# Altium schematic sheet LM2596 Adjustable_AMS1117.SchDoc
size A
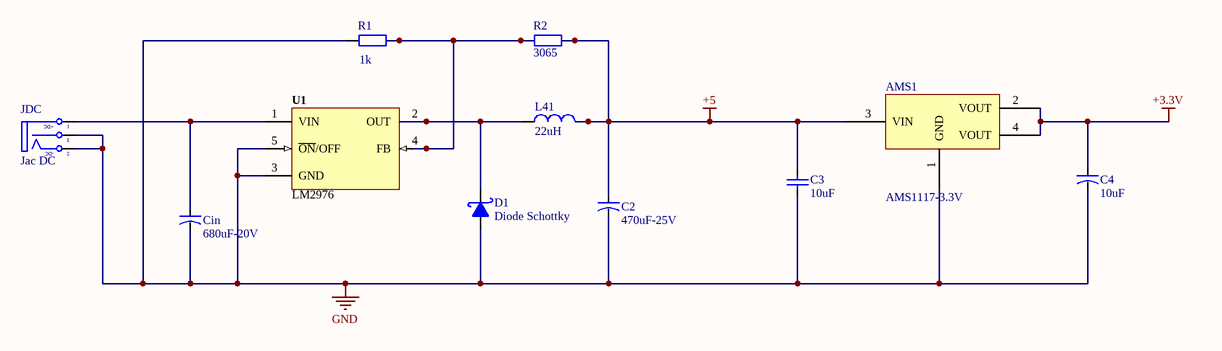
[diagram p0: LM2596 Adjustable_AMS1117.SchDoc]

## Parts
AMS1  AMS1117-3.3V  [SOT223]
C2  470uF-25V  [CAP_D16]
C3  10uF  [CAP_0805]
C4  10uF  [CAP_D16]
Cin  680uF-20V  [CAP_D16]
D1  Diode Schottky  [DIODE_ZENER_SMD]
JDC  Jac DC  [DC-IN]
L41  22uH  [Inductor_SMD]
R1  1k  [RES-SMD-0805]
R2  3065  [RES_SMD_0805]
U1  LM2976  [LM2576t]

## Nets
+3.3V: AMS1.2(VOUT) AMS1.4(VOUT) C4.1
+5: AMS1.3(VIN) C2.1 C3.2 L41.2 R2.1
GND: AMS1.1(GND) C2.2 C3.1 C4.2 Cin.2 D1.1(A) JDC.2(TN) JDC.3(S) R1.2 U1.3(GND) U1.5(~{ON}/OFF)
NetCin_1: Cin.1 JDC.1(T) U1.1(VIN)
NetD1_2: D1.2(K) L41.1 U1.2(OUT)
NetR1_1: R1.1 R2.2 U1.4(FB)

## Notes on the sheet
- (in symbol DCIN) +DC; -DC

## Library data of the parts
AMS1 = AMS1117 SMD: Dán; Value: AMS1117-3.3V SOT223; Don_Vi: Con; Ma_Hang: MH000596; Ghi_Chu: *; Kieu_Chan: *; Chung_Loai: Dán
C2 C4 Cin = CAP-ALU-DIP: Capacitor (Semiconductor SIM Model); Value: 104; LatestRevisionDate: 17-Jul-2002; LatestRevisionNote: Re-released for DXP Platform.; PackageReference: C1206; Publisher: Altium Limited
C3 = CapSMD: Capacitor; Value: 33p; Published: 8-Jun-2000; LatestRevisionDate: 17-Jul-2002; LatestRevisionNote: Re-released for DXP Platform.; PackageReference: RAD-0.3; Publisher: Altium Limited
D1 = Diode Schottky: Generic Diode Schottky
JDC = DCIN: Jac DC input; Value: Jac DC
L41 = L1: Inductor; Value: 150 mH
R1 R2 = Resistor - SMD: Resistor SMD; Manufacturer: Generic Components; Class: Passive; Published: 08/06/2000; Publisher: Altium Hobart Technology Centre
U1 = LM2596: Max Input Voltage: 12 V; Max Output Current: 3 (6.0 peak) A; Max Output Voltage: mV; Category: IC-Power; Min Input Voltage: mV; Min Output Voltage: mV; Mounting Technology: Surface Mount; Status: Unreleased; Supply Voltage: mV; Temperature Range: -40 to +125 degC